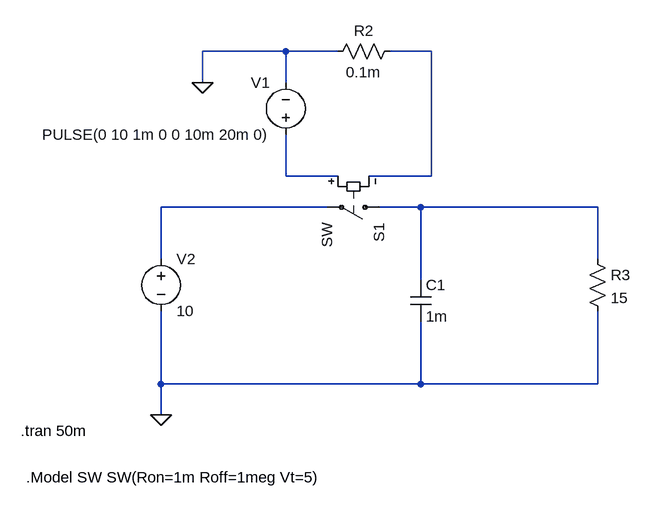
[diagram p0: schematic condensor_v1.asc]
condensor_v1.asc, the LTspice schematic file:
Version 4.1
SHEET 1 880 680
WIRE 304 -176 176 -176
WIRE 384 -176 304 -176
WIRE 528 -176 464 -176
WIRE 176 -128 176 -176
WIRE 304 -128 304 -176
WIRE 304 16 304 -48
WIRE 384 16 304 16
WIRE 528 16 528 -176
WIRE 528 16 432 16
WIRE 368 64 112 64
WIRE 512 64 448 64
WIRE 784 64 512 64
WIRE 112 144 112 64
WIRE 784 144 784 64
WIRE 512 176 512 64
WIRE 112 336 112 224
WIRE 512 336 512 240
WIRE 512 336 112 336
WIRE 784 336 784 224
WIRE 784 336 512 336
WIRE 112 384 112 336
FLAG 176 -128 0
FLAG 112 384 0
SYMBOL sw 464 64 R90
SYMATTR InstName S1
SYMBOL voltage 304 -32 R180
WINDOW 0 24 96 Left 2
WINDOW 3 24 16 Left 2
WINDOW 123 0 0 Left 0
WINDOW 39 0 0 Left 0
SYMATTR InstName V1
SYMATTR Value PULSE(0 10 1m 0 0 10m 20m 0)
SYMBOL res 480 -192 R90
WINDOW 0 0 56 VBottom 2
WINDOW 3 32 56 VTop 2
SYMATTR InstName R2
SYMATTR Value 0.1m
SYMBOL res 768 128 R0
SYMATTR InstName R3
SYMATTR Value 15
SYMBOL voltage 112 128 R0
WINDOW 123 0 0 Left 0
WINDOW 39 0 0 Left 0
SYMATTR InstName V2
SYMATTR Value 10
SYMBOL cap 496 176 R0
SYMATTR InstName C1
SYMATTR Value 1m
TEXT -104 408 Left 2 !.tran 50m
TEXT -96 480 Left 2 !.Model SW SW(Ron=1m Roff=1meg Vt=5)

The netlist it stands for:
* condensor_v1.asc
S1 N004 N003 N002 N001 SW
V1 N002 0 PULSE(0 10 1m 0 0 10m 20m 0)
R2 N001 0 0.1m
R3 N004 0 15
V2 N003 0 10
C1 N004 0 1m
.tran 50m
.Model SW SW(Ron=1m Roff=1meg Vt=5)
.backanno
.end